# EAGLE design lm317 (EAGLE 7.2.0)
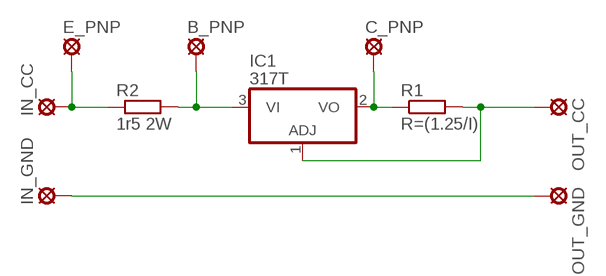
[diagram p0: schematic, sheet 1]

## Parts
B_PNP  SE14  [SE14]
C_PNP  SE14  [SE14]
E_PNP  SE14  [SE14]
IC1  317T  [TO220H]
IN_CC  SE14  [SE14]
IN_GND  SE14  [SE14]
OUT_CC  SE14  [SE14]
OUT_GND  SE14  [SE14]
R1  R=(1.25/I)  R-EU_0617/22  [0617/22]
R2  1r5 2W  R-EU_0617/22  [0617/22]

## Nets
N$1: E_PNP.MP IN_CC.MP R2.1
N$2: B_PNP.MP IC1.3(VI) R2.2
N$3: C_PNP.MP IC1.2(VO) R1.1
N$4: IC1.1(ADJ) OUT_CC.MP R1.2
N$5: IN_GND.MP OUT_GND.MP

## Library data of the parts
B_PNP C_PNP E_PNP IN_CC IN_GND OUT_CC OUT_GND = solpad:SE14: SOLDER PAD E1553, drill 1,4mm, distributor Buerklin, 07F820
IC1 = linear:*317: Positive VOLTAGE REGULATOR
R1 R2 = rcl:R-EU_: RESISTOR, European symbol

## Board
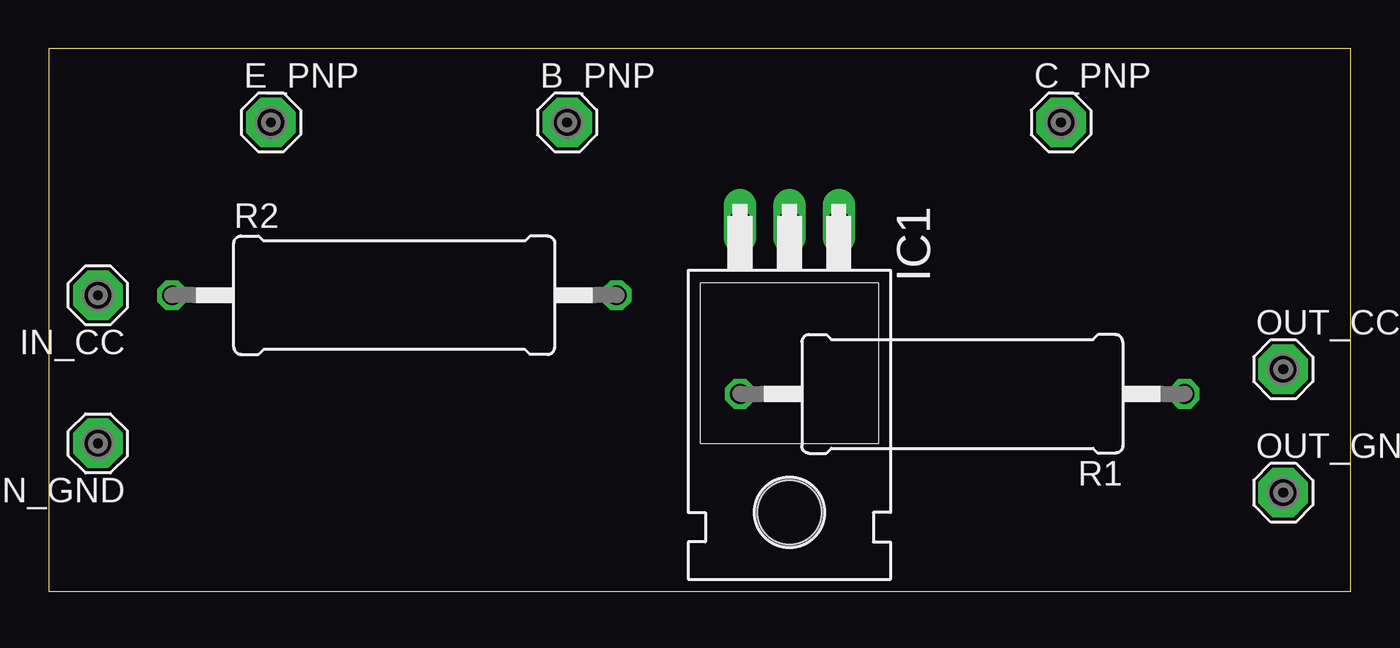
[diagram p1: board, top side]
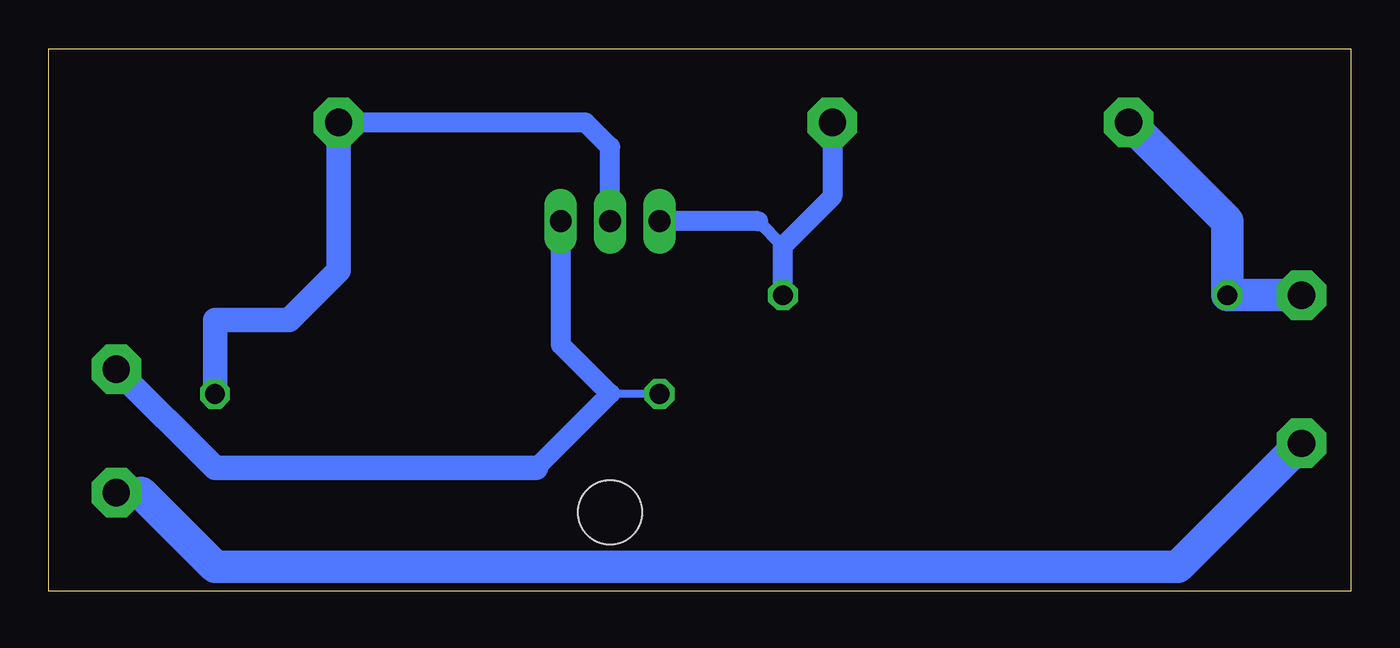
[diagram p2: board, bottom side, seen from below]

Size 66.98 x 27.93 mm. Coordinates in mm from the lower left corner, seen from the top.
Outline: 0,0 66.98,0 66.98,27.93 0,27.93 0,0
Copper layers (1*16): Top 0.035mm / dielectric 1.5mm / Bottom 0.035mm
Design rules "default": minimum track width 10mil, minimum drill 24mil, track to track 8mil, track to pad 8mil, pad to pad 8mil, via to via 8mil, smd to smd 8mil, copper to edge 40mil, drill to drill 8mil, minimum pad ring 10mil, minimum via ring 8mil, stop-mask expansion 4mil, vias tented up to drill 0mil, thermal gap 10mil

### Footprints (pad centres in the part's own frame; a part is rotated, then mirrored left to right if it is on the bottom)
SE14 = drill 1.397 pad 2.54 octagon: MP 0,0
TO220H = drill 1.118 long: 1 -2.54,-10.16; 2 0,-10.16; 3 2.54,-10.16 | hole 3.302: 0,4.826
0617/22 = drill 1.016 octagon: 1 -11.43,0; 2 11.43,0

### Placement (x,y rotation side)
B_PNP  26.67,24.13 0 top
C_PNP  52.07,24.13 0 top
E_PNP  11.43,24.13 0 top
IC1  38.1,8.89 180 top
IN_CC  2.54,15.24 180 top
IN_GND  2.54,7.62 180 top
OUT_CC  63.5,11.43 0 top
OUT_GND  63.5,5.08 0 top
R1  46.99,10.16 180 top
R2  17.78,15.24 0 top

### Tracks (layer width: path | path; a pad name or v marks a point on that pad's centre or on a via)
N$1
  Bottom 1.676: IN_CC.MP R2.1 6.35,19.05 E_PNP.MP
N$2
  Bottom 0.61: 29.21,17.78 30.48,19.05
  Bottom 1.016: B_PNP.MP 26.67,20.32 29.21,17.78 R2.2 | 30.48,19.05 IC1.3
N$3
  Bottom 1.016: IC1.2 38.1,22.86 39.37,24.13 C_PNP.MP
  Bottom 1.27: C_PNP.MP 52.07,16.51 54.61,13.97 58.42,13.97 R1.1
N$4
  Bottom 0.406: R1.2 38.1,10.16
  Bottom 1.016: IC1.1 40.64,12.7 38.1,10.16 41.91,6.35
  Bottom 1.27: 41.91,6.35 58.42,6.35 OUT_CC.MP
N$5
  Bottom 0.406: 62.23,5.08 OUT_GND.MP
  Bottom 1.676: IN_GND.MP 8.89,1.27 58.42,1.27 62.23,5.08